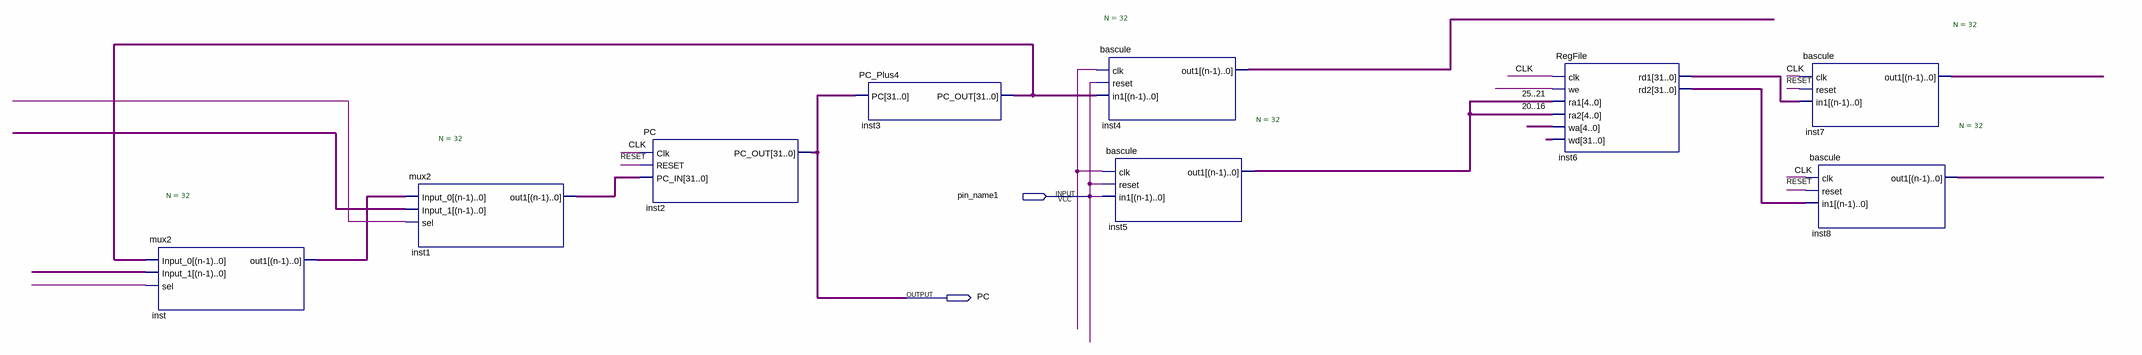
[diagram p0: schematic sheet]
// Quartus schematic AAAAAAA.bdf as structural Verilog: 9 symbols, 2 pins
module AAAAAAA (
  input  pin_name1,
  output PC
);

  wire \20..16 , \25..21 , CLK, RESET, undriven_3, undriven_4, undriven_5, undriven_8;
  wire [4:0] undriven_6;
  wire [31:0] inst1_out1, inst2_pc_out, inst3_pc_out, inst4_out1, inst6_rd1, inst6_rd2, inst7_out1,
       inst8_out1, inst_out1, undriven, undriven_2, undriven_7;

  mux2 #(.N(32)) inst (.Input_0(inst3_pc_out), .Input_1(undriven_2), .sel(undriven_4), .out1(inst_out1));
  mux2 #(.N(32)) inst1 (.Input_0(inst_out1), .Input_1(undriven), .sel(undriven_3), .out1(inst1_out1));
  PC inst2 (.Clk(CLK), .RESET(RESET), .PC_IN(inst1_out1), .PC_OUT(inst2_pc_out));
  PC_Plus4 inst3 (.PC(inst2_pc_out), .PC_OUT(inst3_pc_out));
  bascule #(.N(32)) inst4 (.clk(undriven_5), .reset(pin_name1), .in1(inst3_pc_out), .out1(inst4_out1));
  bascule #(.N(32)) inst5 (.clk(undriven_5), .reset(pin_name1), .in1({32{pin_name1}}), .out1(\25..21 ));
  RegFile inst6 (
    .clk(CLK), .we(undriven_8), .ra1({5{\25..21 }}), .ra2({5{\20..16 }}), .wa(undriven_6), .wd(undriven_7),
    .rd1(inst6_rd1), .rd2(inst6_rd2));
  bascule #(.N(32)) inst7 (.clk(CLK), .reset(RESET), .in1(inst6_rd1), .out1(inst7_out1));
  bascule #(.N(32)) inst8 (.clk(CLK), .reset(RESET), .in1(inst6_rd2), .out1(inst8_out1));
endmodule
